# EAGLE schematic Sensor_Board_Try2 (EAGLE 8.1.0)
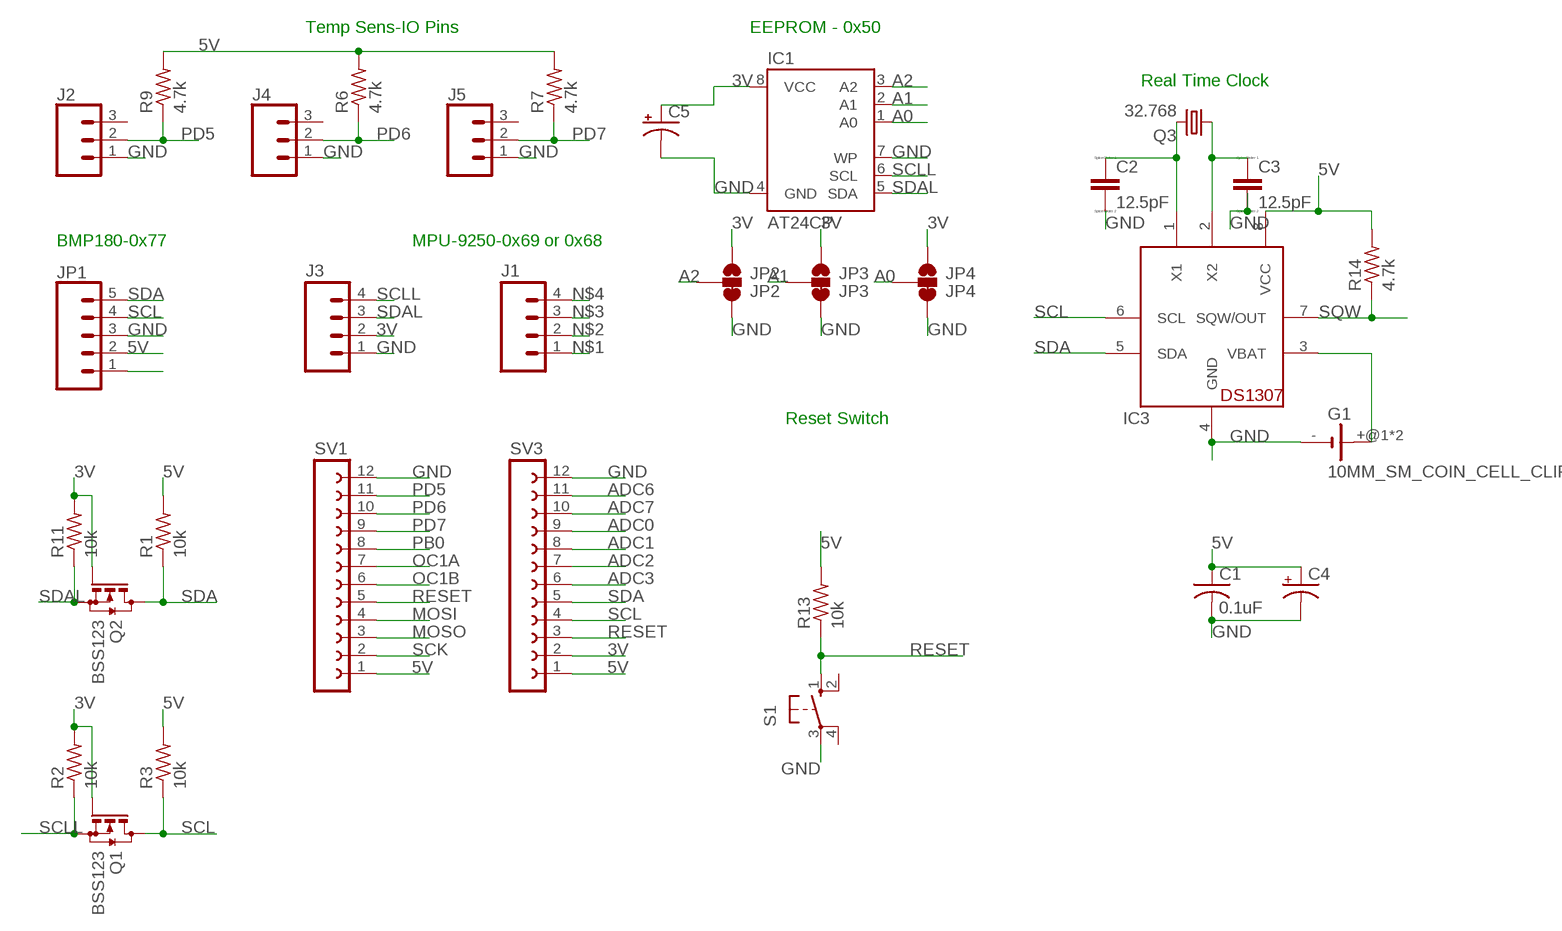
[diagram p0: schematic, sheet 1]

## Parts
C1  0.1uF  C-US025-025X050  [C025-025X050]
C2  12.5pF  C  [C0805]
C3  12.5pF  C  [C0805]
C4  CPOL-USE2-4  [E2-4]
C5  CPOL-USE2-4  [E2-4]
G1  10MM_SM_COIN_CELL_CLIP  [10MM_SM_COIN_CELL_CLIP]
IC1  AT24CP  [DIL08]
IC3  DS1307  [DIL08]
J1  M04PTH  [1X04]
J2  CONN_03  [1X03]
J3  M04PTH  [1X04]
J4  CONN_03  [1X03]
J5  CONN_03  [1X03]
JP1  CONN_05  [1X05]
JP2  JP2  JUMPER-SMT_3_1-NC_TRACE_SILK  [SMT-JUMPER_3_1-NC_TRACE_SILK]
JP3  JP3  JUMPER-SMT_3_1-NC_TRACE_SILK  [SMT-JUMPER_3_1-NC_TRACE_SILK]
JP4  JP4  JUMPER-SMT_3_1-NC_TRACE_SILK  [SMT-JUMPER_3_1-NC_TRACE_SILK]
Q1  BSS123  [SOT23]
Q2  BSS123  [SOT23]
Q3  32.768  CRYTALTC38H  [TC38H]
R1  10k  R-US_M0805  [M0805]
R2  10k  R-US_M0805  [M0805]
R3  10k  R-US_M0805  [M0805]
R6  4.7k  R-US_M0805  [M0805]
R7  4.7k  R-US_M0805  [M0805]
R9  4.7k  R-US_M0805  [M0805]
R11  10k  R-US_M0805  [M0805]
R13  10k  R-US_M0805  [M0805]
R14  4.7k  R-US_M0805  [M0805]
S1  10-XX  [B3F-10XX]
SV1  FE12-1  [FE12]
SV3  FE12-1  [FE12]

## Nets
3V: C5.+ IC1.8(VCC) J3.2 JP2.1 JP3.1 JP4.1 Q1.1(G) Q2.1(G) R2.2 R11.2 SV3.2
5V: C1.1 C4.+ IC3.8(VCC) JP1.2 R1.2 R3.2 R6.2 R7.2 R9.2 R13.2 R14.2 SV1.1 SV3.1
A0: IC1.1(A0) JP4.2
A1: IC1.2(A1) JP3.2
A2: IC1.3(A2) JP2.2
ADC0: SV3.9
ADC1: SV3.8
ADC2: SV3.7
ADC3: SV3.6
ADC6: SV3.11
ADC7: SV3.10
GND: C1.2 C2.2 C3.2 C4.- C5.- G1.- IC1.4(GND) IC1.7(WP) IC3.4(GND) J2.1 J3.1 J4.1 J5.1 JP1.3 JP2.3 JP3.3 JP4.3 S1.3(P) SV1.12 SV3.12
MOSI: SV1.4
MOSO: SV1.3
N$1: J1.1
N$2: J1.2
N$3: J1.3
N$4: J1.4
N$5: JP1.1
N$14: C2.1 IC3.1(X1) Q3.2
N$15: C3.1 IC3.2(X2) Q3.1
OC1A: SV1.7
OC1B: SV1.6
PB0: SV1.8
PD5: J2.2 R9.1 SV1.11
PD6: J4.2 R6.1 SV1.10
PD7: J5.2 R7.1 SV1.9
RESET: R13.1 S1.1(S) SV1.5 SV3.3
SCK: SV1.2
SCL: IC3.6(SCL) JP1.4 Q1.3(D) R3.1 SV3.4
SCLL: IC1.6(SCL) J3.4 Q1.2(S) R2.1
SDA: IC3.5(SDA) JP1.5 Q2.3(D) R1.1 SV3.5
SDAL: IC1.5(SDA) J3.3 Q2.2(S) R11.1
SQW: IC3.7(SQW/OUT) R14.1
VBAT: G1.+@1(+) G1.+@2(+) IC3.3(VBAT)
Unconnected: J2.3 J4.3 J5.3 S1.2(S1) S1.4(P1)

## Notes on the sheet
- Temp Sens-IO Pins | EEPROM - 0x50
- Real Time Clock
- BMP180-0x77 | MPU-9250-0x69 or 0x68
- Reset Switch

## Library data of the parts
C1 = adafruit:C-US: CAPACITOR, American symbol
C2 C3 = eagle-ltspice:C: CAPACITOR, European symbol; SPICEMODEL: NONE; SPICEPREFIX: C
C4 C5 = rcl:CPOL-US: POLARIZED CAPACITOR, American symbol
G1 = battery:10MM_SM_COIN_CELL_CLIP: Battery cell clip for CR927 Source: KEYSTONE ELECTRONICS CORP. www.keyelco.com, ASTORIA, N.Y. 11105-2017 PART ANME 10mm SM COIN CELl CLIP DWG NO. 3030
IC1 = atmel:AT24C*: 2-wire serial EEPROM; MPN: AT24C1024BW-SH-B; OC_FARNELL: 1362646; OC_NEWARK: 03P2044
IC3 = adafruit:DS1307: DS1307 Real time clock (RTC) with battery backup ability. Talk to it via i2c
J1 J3 = SparkFun-Connectors:M04: Header 4 Standard 4-pin 0.1" header. Use with straight break away headers (SKU : PRT-00116), right angle break away headers (PRT-00553), swiss pins (PRT-00743), machine pins (PRT-00117), and female headers (PRT-00115). Molex polarized connector foot print use with SKU : PRT-08231 with associated crimp pins and housings. 1MM SMD Version SKU: PRT-10208; PROD_ID: CONN-09696
J2 J4 J5 = SparkFun-Connectors:CONN_03: Multi connection point. Often used as Generic Header-pin footprint for 0.1 inch spaced/style header connections On any of the 0.1 inch spaced packages, you can populate with these: Break Away Headers - Straight <https://www.sparkfun.com/products/116> (PRT-00116) Break Away Male Headers - Right Angle <https://www.sparkfun.com/products/553> (PRT-00553) Female Headers <https://www.sparkfun.com/products/115> (PRT-00115) Break Away Headers - Machine Pin <https://www.sparkfun.com/products/117> (PRT-00117) Break Away Female Headers - Swiss Machine Pin <https://www.sparkfun.com/products/743> (PRT-00743) Stackable Header - 3 Pin (Female, 0.1") <https://www.sparkfun.com/products/13875> (PRT-13875) For SCREWTERMINALS and SPRING TERMINALS visit here: Screw Terimnals on SparkFun.com <https://www.sparkfun.com/search/results?term=Screw+Terminals> (5mm/3.5mm/2.54mm spacing) This device is also useful as a general connection point to wire up your design to another part of your project. Our various solder wires solder well into these plated through hole pads. Hook-Up Wire - Assortment (Stranded, 22 AWG) <https://www.sparkfun.com/products/11375> (PRT-11375) Hook-Up Wire - Assortment (Solid Core, 22 AWG) <https://www.sparkfun.com/products/11367> (PRT-11367) View the entire wire category on our website here <https://www.sparkfun.com/categories/141> Special notes: Molex polarized connector foot print use with SKU : PRT-08232 with associated crimp pins and housings.
JP1 = SparkFun-Connectors:CONN_05: Multi connection point. Often used as Generic Header-pin footprint for 0.1 inch spaced/style header connections On any of the 0.1 inch spaced packages, you can populate with these: Break Away Headers - Straight <https://www.sparkfun.com/products/116> (PRT-00116) Break Away Male Headers - Right Angle <https://www.sparkfun.com/products/553> (PRT-00553) Female Headers <https://www.sparkfun.com/products/115> (PRT-00115) Break Away Headers - Machine Pin <https://www.sparkfun.com/products/117> (PRT-00117) Break Away Female Headers - Swiss Machine Pin <https://www.sparkfun.com/products/743> (PRT-00743) For SCREWTERMINALS and SPRING TERMINALS visit here: Screw Terimnals on SparkFun.com <https://www.sparkfun.com/search/results?term=Screw+Terminals> (5mm/3.5mm/2.54mm spacing) This device is also useful as a general connection point to wire up your design to another part of your project. Our various solder wires solder well into these plated through hole pads. Hook-Up Wire - Assortment (Stranded, 22 AWG) <https://www.sparkfun.com/products/11375> (PRT-11375) Hook-Up Wire - Assortment (Solid Core, 22 AWG) <https://www.sparkfun.com/products/11367> (PRT-11367) View the entire wire category on our website here <https://www.sparkfun.com/categories/141> Special notes: Molex polarized connector foot print use with SKU : PRT-08231 with associated crimp pins and housings. 1MM SMD Version SKU: PRT-10208
JP2-JP4 = SparkFun-Jumpers:JUMPER-SMT_3_1-NC_TRACE: Normally closed trace jumper (1 of 2 connections) This jumper has a trace between two pads so it's normally closed (NC). The other connection is normally open (NO). Use a razor knife to open the connection. For best results follow the IPC guidelines for cutting traces: Cutout at least 0.063 mm (0.005 in). Remove all loose material to clean up the cut area. Seal the cut with an approved epoxy. Reapply solder to reclose the connection, or to close the NO connection.
Q1 Q2 = transistor-small-signal:BSS123: N-CHANNEL MOS FET
Q3 = crystal:CRYTAL: CRYSTAL
R1-R3 R6 R7 R9 R11 R13 R14 = rcl:R-US_: RESISTOR, American symbol
S1 = switch-omron:10-XX: OMRON SWITCH; MPN: B3F-1000; OC_FARNELL: 176432; OC_NEWARK: 36M3542
SV1 SV3 = con-lsta:FE12-1: FEMALE HEADER; OC_FARNELL: unknown; OC_NEWARK: unknown